# EAGLE design DCZia MechKeyBadge (EAGLE 8.2.1)
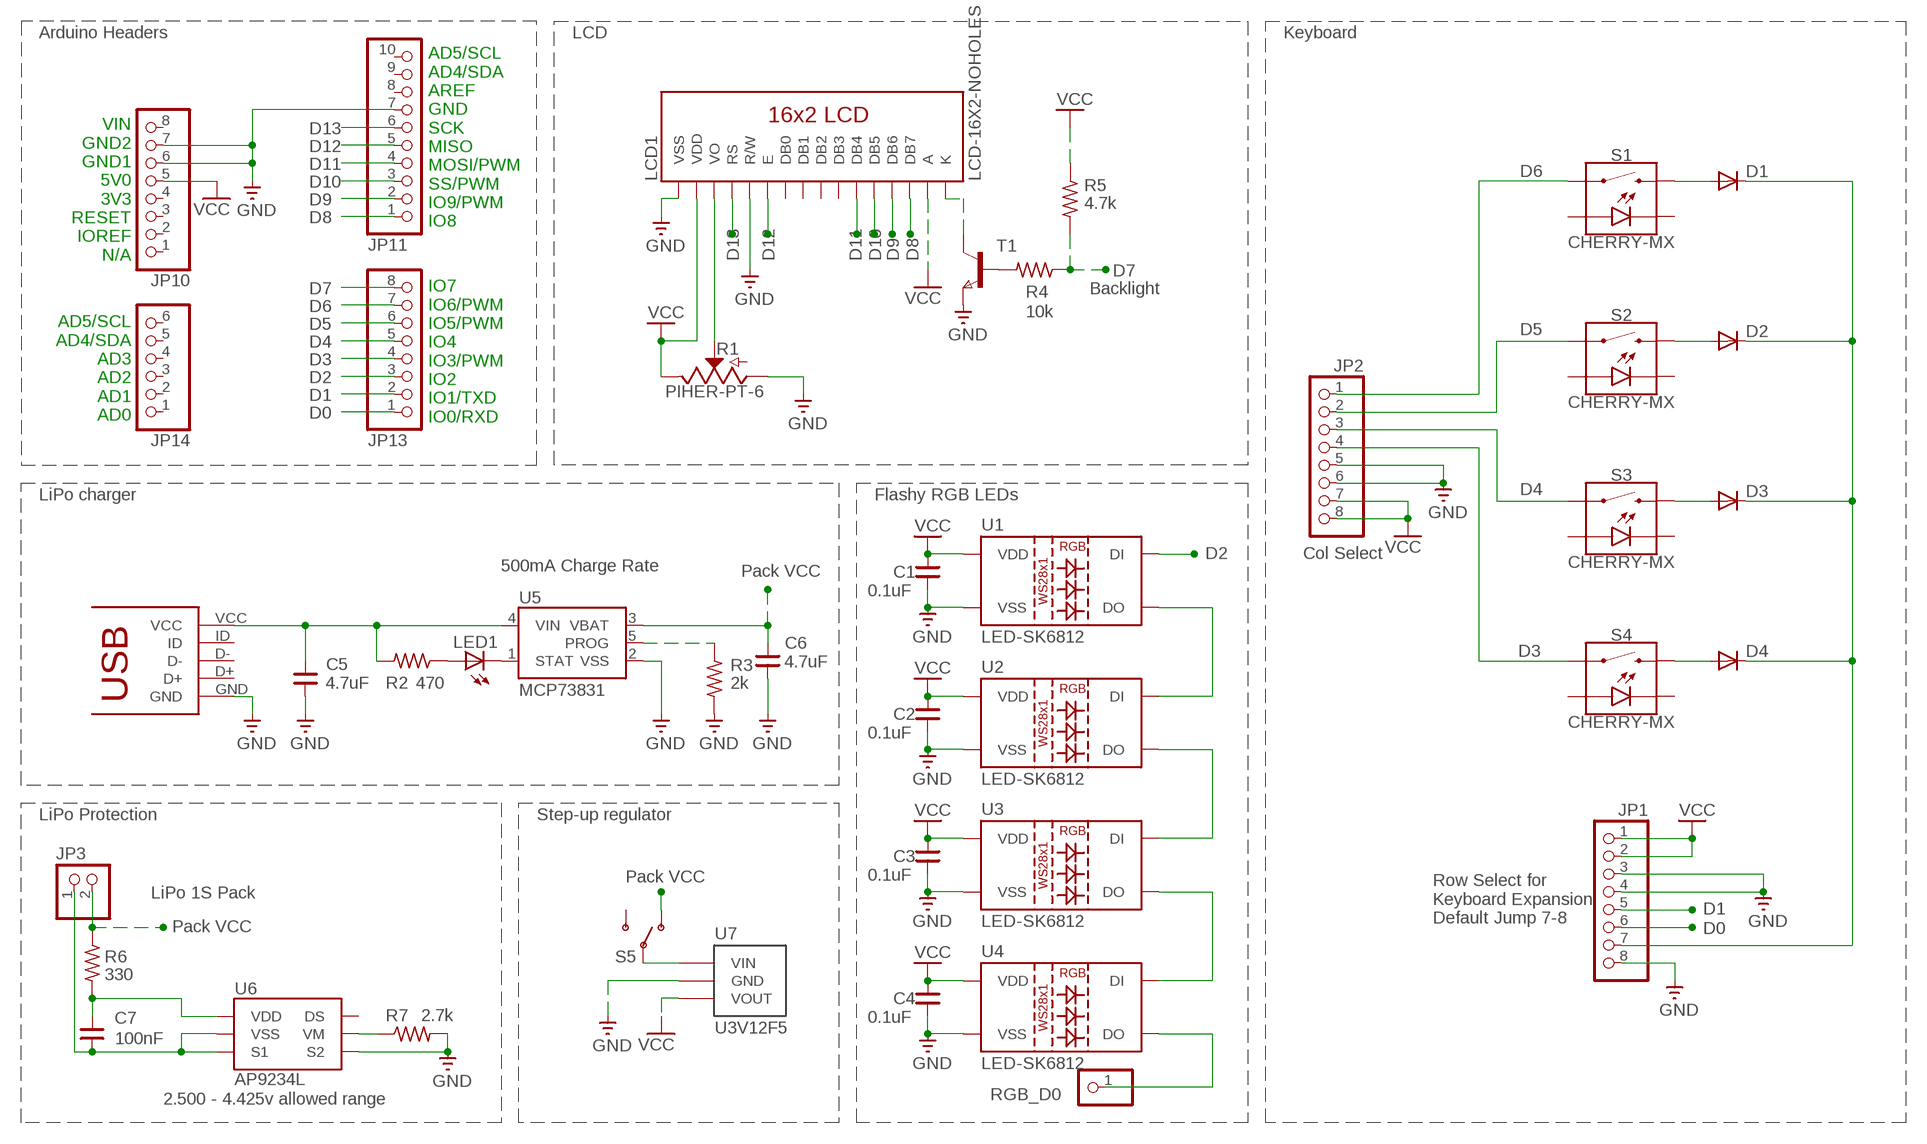
[diagram p0: schematic, sheet 1]

## Parts
C1  0.1uF  CNP-1206  [1206]
C2  0.1uF  CNP-1206  [1206]
C3  0.1uF  CNP-1206  [1206]
C4  0.1uF  CNP-1206  [1206]
C5  4.7uF  CNP-1206  [1206]
C6  4.7uF  CNP-1206  [1206]
C7  100nF  CNP-1206  [1206]
D1  DIODE-SOD123  [SOD123]
D2  DIODE-SOD123  [SOD123]
D3  DIODE-SOD123  [SOD123]
D4  DIODE-SOD123  [SOD123]
JP1  PINHD-1X8  [1X08]
JP2  PINHD-1X8  [1X08]
JP3  PINHD-1X2  [1X02]
JP10  PINHD-1X8  [1X08]
JP11  PINHD-1X10  [1X10]
JP13  PINHD-1X8  [1X08]
JP14  PINHD-1X6  [1X06]
LCD1  LCD-16X2-NOHOLES  [LCD-16X2]
LED1  LEDSMT1206  [1206]
R1  PIHER-PT-6  [PIHER-PT-6]
R2  470  R-US_R1206  [R1206]
R3  2k  R-US_R1206  [R1206]
R4  10k  R-US_R1206  [R1206]
R5  4.7k  R-US_R1206  [R1206]
R6  330  R-US_R1206  [R1206]
R7  2.7k  R-US_R1206  [R1206]
RGB_D0  PINHD-1X1  [1X01]
S1  CHERRY-MX  [CHERRY-MX-LED]
S2  CHERRY-MX  [CHERRY-MX-LED]
S3  CHERRY-MX  [CHERRY-MX-LED]
S4  CHERRY-MX  [CHERRY-MX-LED]
S5  SWITCH-SPDTSMD  [SWITCH_SPDT_SMD]
T1  NPNSOT23  [SOT-23]
U1  LED-SK6812  [SK6812]
U2  LED-SK6812  [SK6812]
U3  LED-SK6812  [SK6812]
U4  LED-SK6812  [SK6812]
U5  MCP73831  [SOT23-5]
U6  AP9234L  [U-DFN2535-6]
U7  U3V12F5  [POLOLU_REGULATOR]
U$1  10118192-0001LF  [10118192-0001LF]

## Nets
D0: JP1.6 JP13.1
D1: JP1.5 JP13.2
D2: JP13.3 U1.P$2(DI)
D3: JP2.4 JP13.4 S4.S1
D4: JP2.3 JP13.5 S3.S1
D5: JP2.2 JP13.6 S2.S1
D6: JP2.1 JP13.7 S1.S1
D7: JP13.8 R4.1 R5.2
D8: JP11.1 LCD1.14(DB7)
D9: JP11.2 LCD1.13(DB6)
D10: JP11.3 LCD1.12(DB5)
D11: JP11.4 LCD1.11(DB4)
D12: JP11.5 LCD1.6(E)
D13: JP11.6 LCD1.4(RS)
GND: C1.P$1 C2.P$1 C3.P$1 C4.P$1 C5.P$1 C6.P$1 JP1.3 JP1.4 JP1.8 JP2.5 JP2.6 JP10.6 JP10.7 JP11.7 LCD1.1(VSS) LCD1.5(R/W) R1.P$1 R3.2 R7.2 T1.2(E) U1.P$1(VSS) U2.P$1(VSS) U3.P$1(VSS) U4.P$1(VSS) U5.2(VSS) U6.S2 U7.2(GND) U$1.GND
N$1: LCD1.3(VO) R1.P$2
N$2: U1.P$4(DO) U2.P$2(DI)
N$3: U2.P$4(DO) U3.P$2(DI)
N$4: U3.P$4(DO) U4.P$2(DI)
N$9: D4.A S4.S2
N$10: D1.A S1.S2
N$11: D2.A S2.S2
N$12: D3.A S3.S2
N$13: LED1.A R2.1
N$14: LED1.C U5.1(STAT)
N$15: R3.1 U5.5(PROG)
N$16: RGB_D0.1 U4.P$4(DO)
N$17: D1.C D2.C D3.C D4.C JP1.7
N$18: R4.2 T1.3(B)
N$19: LCD1.16(K) T1.1(C)
N$20: S5.2(P) U7.3(VIN)
N$21: C5.P$2 R2.2 U5.4(VIN) U$1.VCC
N$22: R7.1 U6.VM
N$23: C7.P$2 JP3.1 U6.S1 U6.VSS
N$24: C7.P$1 R6.2 U6.VDD
PACK_VCC: C6.P$2 JP3.2 R6.1 S5.1(O) U5.3(VBAT)
VCC: C1.P$2 C2.P$2 C3.P$2 C4.P$2 JP1.1 JP1.2 JP2.7 JP2.8 JP10.5 LCD1.2(VDD) LCD1.15(A) R1.P$3 R5.1 U1.P$3(VDD) U2.P$3(VDD) U3.P$3(VDD) U4.P$3(VDD) U7.1(VOUT)
Unconnected: JP10.1 JP10.2 JP10.3 JP10.4 JP10.8 JP11.8 JP11.9 JP11.10 JP14.1 JP14.2 JP14.3 JP14.4 JP14.5 JP14.6 LCD1.7(DB0) LCD1.8(DB1) LCD1.9(DB2) LCD1.10(DB3) S1.A S1.K(C) S2.A S2.K(C) S3.A S3.K(C) S4.A S4.K(C) S5.3(S) U6.DS U$1.D+ U$1.D- U$1.ID

## Notes on the sheet
- Arduino Headers | LCD | Keyboard
- D13
- D12
- D11
- D6
- D10
- D9
- D8
- AD5/SCL
  AD4/SDA
  AREF
  GND
  SCK
  MISO
  MOSI/PWM
  SS/PWM
  IO9/PWM
  IO8
- VIN
  GND2
  GND1
  5V0
  3V3
  RESET
  IOREF
  N/A
- D13 | D12 | D11 | D10 | D9 | D8
- D7
- D7 | Backlight
- D6
- D5
- D5
- D4
- D3
- D2
- D1
- D0
- AD5/SCL
  AD4/SDA
  AD3
  AD2
  AD1
  AD0
- IO7
  IO6/PWM
  IO5/PWM
  IO4
  IO3/PWM
  IO2
  IO1/TXD
  IO0/RXD
- D4
- LiPo charger | Flashy RGB LEDs
- D2 | Col Select
- 500mA Charge Rate
- Pack VCC
- D3
- LiPo Protection | Step-up regulator
- Pack VCC
- LiPo 1S Pack
- D1
- Row Select for
  Keyboard Expansion
  Default Jump 7-8
- Pack VCC | D0
- 2.500 - 4.425v allowed range

## Library data of the parts
C1-C7 = cap-master:CNP-: NON-POLARIZED CAP
D1-D4 = diode-1:DIODE-: DIODE
JP1 JP2 JP10 JP13 = pinhead:PINHD-1X8: PIN HEADER
JP3 = pinhead:PINHD-1X2: PIN HEADER
JP11 = pinhead:PINHD-1X10: PIN HEADER
JP14 = pinhead:PINHD-1X6: PIN HEADER
LCD1 = snurkle:LCD-16X2-NOHOLES
LED1 = adafruit:LED: LED OSRAM: - CHIPLED LG R971, LG N971, LY N971, LG Q971, LY Q971, LO R971, LY R971 LH N974, LH R974 LS Q976, LO Q976, LY Q976 LO Q996 - Hyper CHIPLED LW Q18S LB Q993, LB Q99A, LB R99A - SideLED LS A670, LO A670, LY A670, LG A670, LP A670 LB A673, LV A673, LT A673, LW A673 LH A674 LY A675 LS A676, LA A676, LO A676, LY A676, LW A676 LS A679, LY A679, LG A679 - Hyper Micro SIDELED® LS Y876, LA Y876, LO Y876, LY Y876 LT Y87S - SmartLED LW L88C, LW L88S LB L89C, LB L89S, LG L890 LS L89K, LO L89K, LY L89K LS L896, LA L896, LO L896, LY L896 - TOPLED LS T670, LO T670, LY T670, LG T670, LP T670 LSG T670, LSP T670, LSY T670, LOP T670, LYG T670 LG T671, LOG T671, LSG T671 LB T673, LV T673, LT T673, LW T673 LH T674 LS T676, LA T676, LO T676, LY T676, LB T676, LH T676, LSB T676, LW T676 LB T67C, LV T67C, LT T67C, LS T67K, LO T67K, LY T67K, LW E67C LS E67B, LA E67B, LO E67B, LY E67B, LB E67C, LV E67C, LT E67C LW T67C LS T679, LY T679, LG T679 LS T770, LO T770, LY T770, LG T770, LP T770 LB T773, LV T773, LT T773, LW T773 LH T774 LS E675, LA E675, LY E675, LS T675 LS T776, LA T776, LO T776, LY T776, LB T776 LHGB T686 LT T68C, LB T68C - Hyper Mini TOPLED® LB M676 - Mini TOPLED Santana® LG M470 LS M47K, LO M47K, LY M47K Source: http://www.osram.convergy.de/
R1 = snurkle:PIHER-PT-6
R2-R7 = resistor:R-US_: RESISTOR, American symbol
RGB_D0 = pinhead:PINHD-1X1: PIN HEADER
S1-S4 = snurkle:CHERRY-MX
S5 = SparkFun-Retired:SWITCH-SPDT: SPDT Switch Simple slide switch, Spark Fun Electronics SKU : COM-00102 DPDT SMT slide switch, AYZ0202, SWCH-08179
T1 = zetex:NPNSOT23: NPN TRANSISTOR; MPN: DSS20201L-7; OC_FARNELL: 1710688; OC_NEWARK: 25R4555
U1-U4 = snurkle:LED-SK6812: SK6812 RGB LED - A 5050LED controller with 3 RGB LEDs in a single package
U5 = SparkFun-IC-Power:MCP73831: MCP73831T Li-Ion, Li-Pol Controller Miniature single cell, fully integrated Li-Ion, Li-polymer charge management controller Datasheet <http://ww1.microchip.com/downloads/en/DeviceDoc/20001984g.pdf> SparkFun Products: SparkFun ESP32 Thing <https://www.sparkfun.com/products/13907> SparkFun 9DoF Razor IMU M0 <https://www.sparkfun.com/products/14001>; PROD_ID: IC-09995
U6 = snurkle:AP9234L: Diodes, Inc Battery Protection chip AP9234L <https://www.diodes.com/assets/Datasheets/AP9234L.pdf>
U7 = snurkle:U3V12F5: Pololu 5V Step-Up Voltage Regulator U3V12F5 <https://www.pololu.com/product/2115>
U$1 = AllAboutEE:10118192-0001LF: USB Connectors 5P MICRO USB TYPE B RECEPTACLE.; COLOR: Black; GENDER: Female

## Board
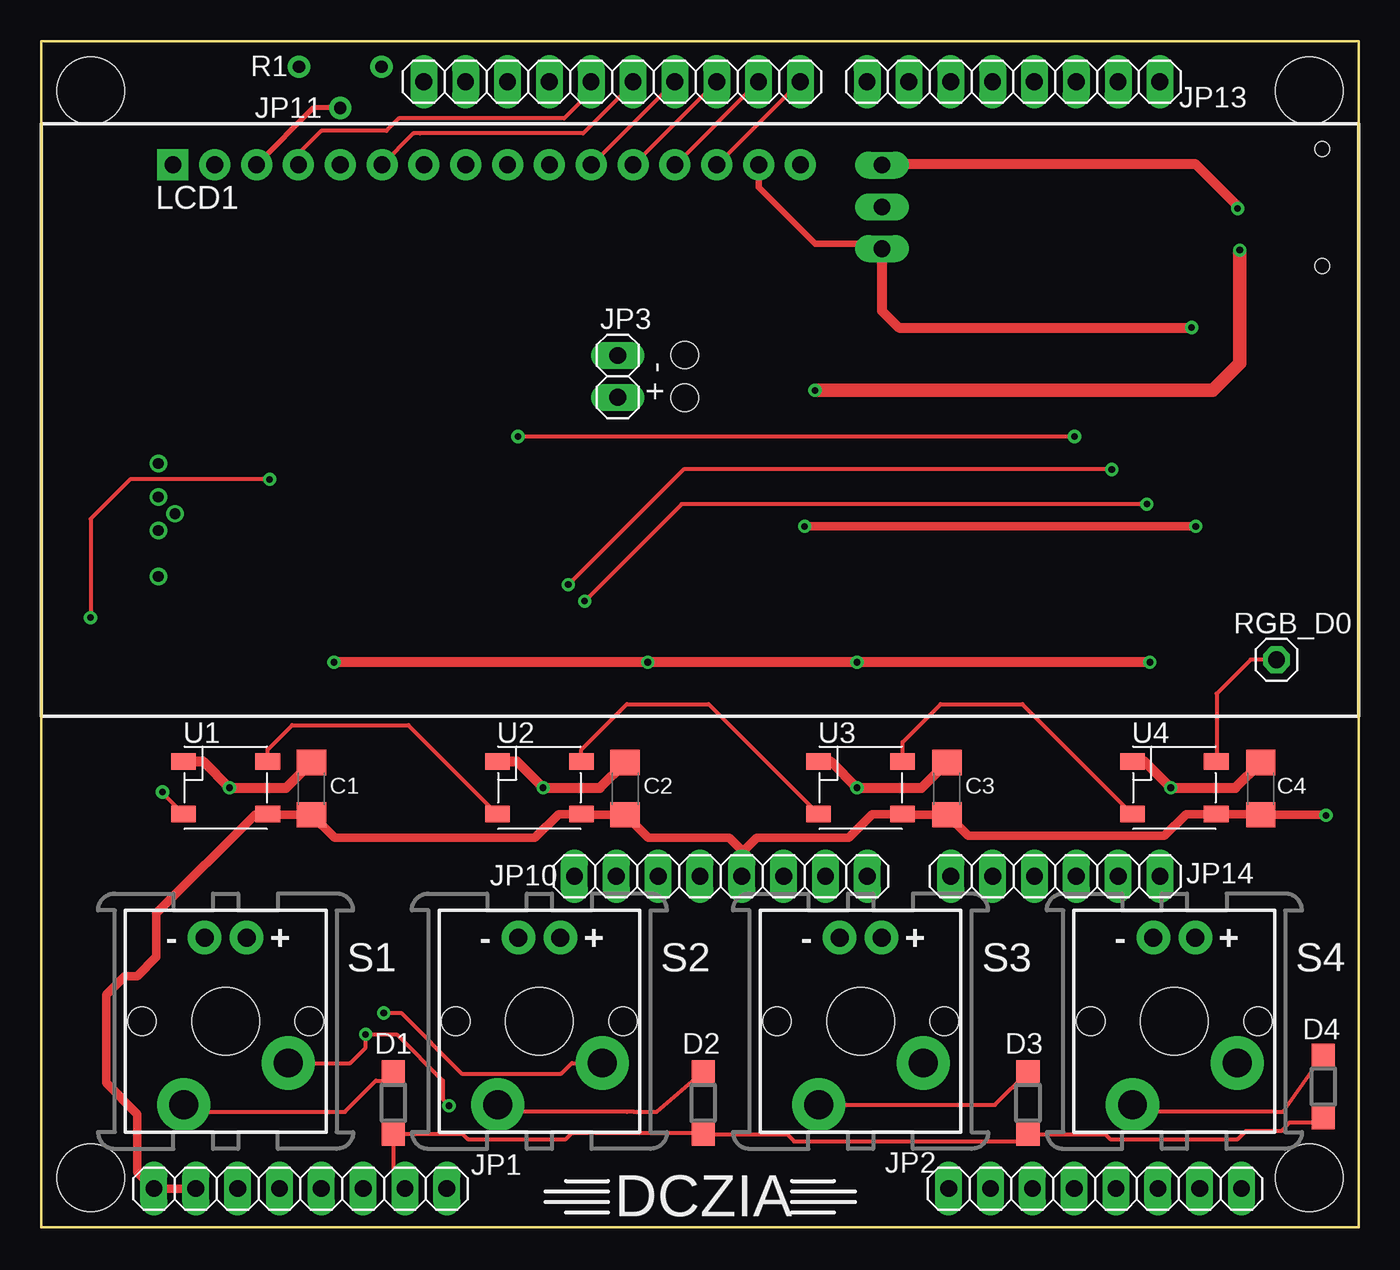
[diagram p1: board, top side]
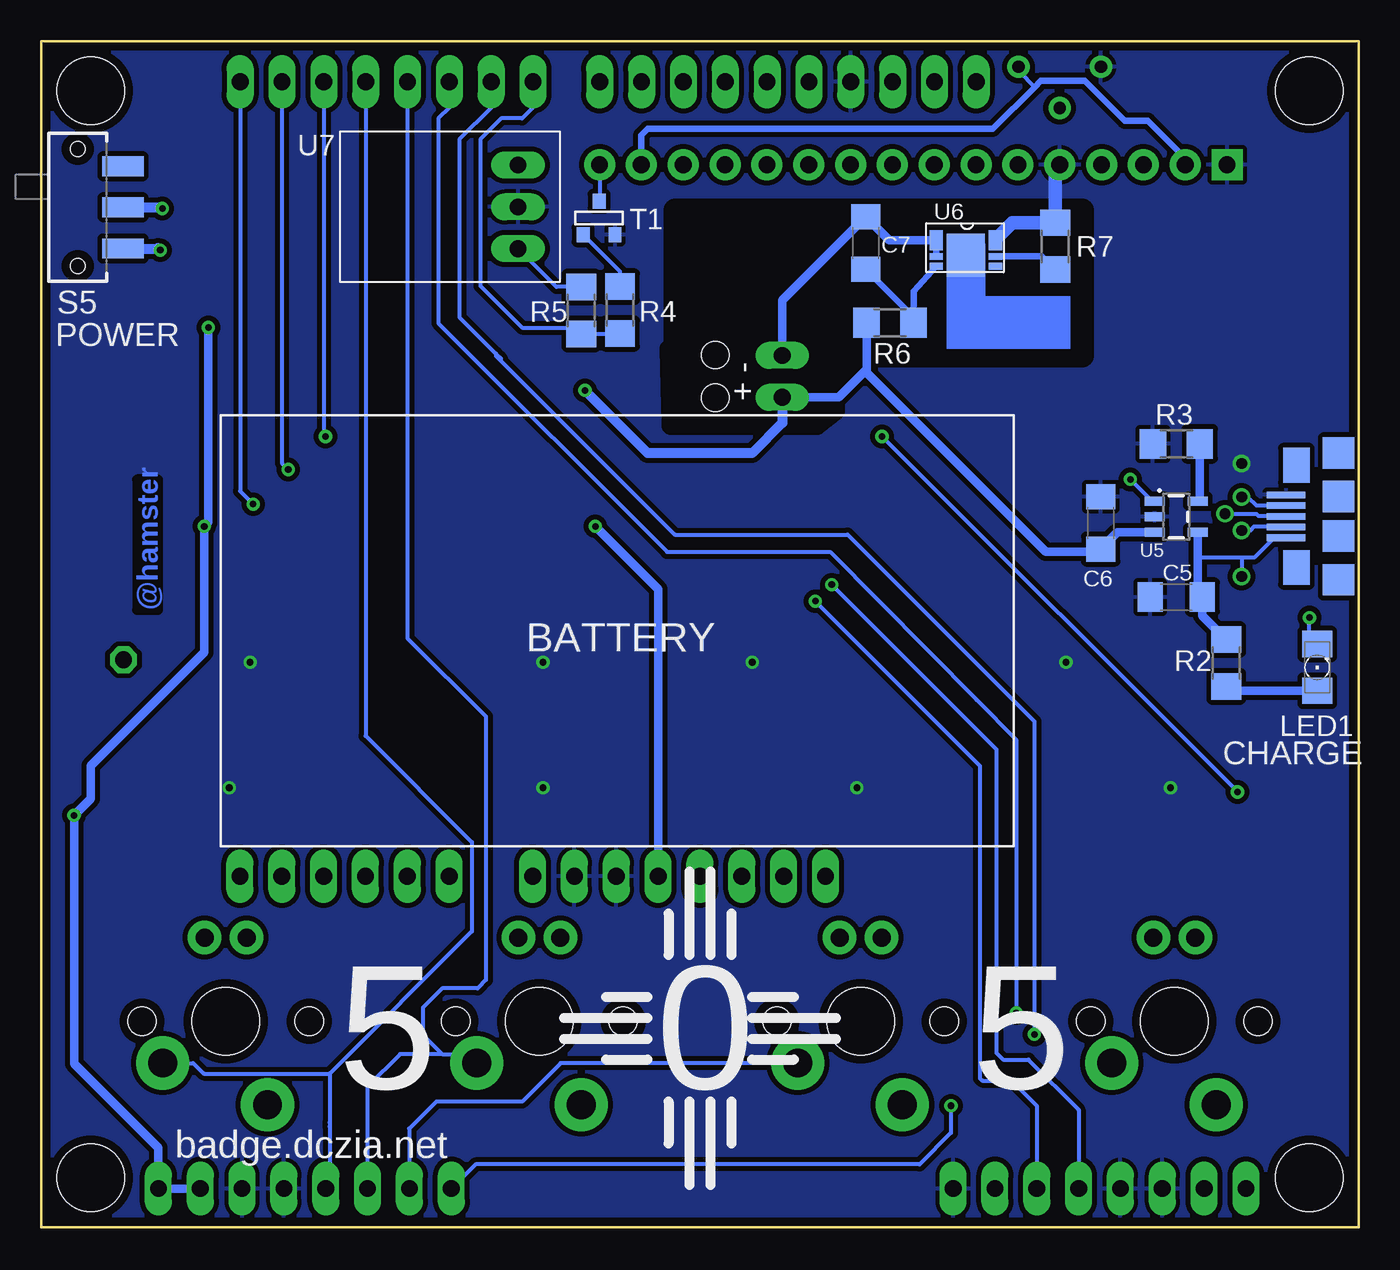
[diagram p2: board, bottom side, seen from below]

Size 80 x 72 mm. Coordinates in mm from the lower left corner, seen from the top.
Outline: 0,0 0,72 80,72 80,0 0,0
Copper layers (1*16): Top 0.0178mm / dielectric 59mil / Bottom 0.0178mm
Design rules "SSC-EAGLE-2Lyr_v1.0.0.3 *": minimum track width 6mil, minimum drill 14mil, track to track 6mil, track to pad 6mil, pad to pad 6mil, via to via 6mil, smd to smd 6mil, copper to edge 20mil, drill to drill 16mil, minimum pad ring 12mil, minimum via ring 8mil, stop-mask expansion 3mil, vias tented up to drill 15mil, thermal gap 10mil
Holes 1.65 mm at 39.08,52.94 39.08,50.35
Holes 4.09 mm at 3,3 77,3 3,69 77,69
bRestrict: area 16.8,52.9 to 41.5,61.7; area 1.9,40.6 to 3.4,45.7; area 31.8,48.6 to 41.9,53.3

### Footprints (pad centres in the part's own frame; a part is rotated, then mirrored left to right if it is on the bottom)
1206 = smd 1.524 x 1.778: P$1 -1.587,0; P$2 1.587,0
SOD123 = smd 1.4 x 1.4: A 1.9,0; C -1.9,0
1X08 = drill 1.016 long: 1 -8.89,0; 2 -6.35,0; 3 -3.81,0; 4 -1.27,0; 5 1.27,0; 6 3.81,0; 7 6.35,0; 8 8.89,0
1X02 = drill 1.016 long: 1 -1.27,0; 2 1.27,0
1X10 = drill 1.016 long: 1 -11.43,0; 2 -8.89,0; 3 -6.35,0; 4 -3.81,0; 5 -1.27,0; 6 1.27,0; 7 3.81,0; 8 6.35,0; 9 8.89,0; 10 11.43,0
1X06 = drill 1.016 long: 1 -6.35,0; 2 -3.81,0; 3 -1.27,0; 4 1.27,0; 5 3.81,0; 6 6.35,0
LCD-16X2 = drill 1.016 pad 1.88 square: 1 -32,15.5 | drill 1.016 pad 1.88: 2 -29.46,15.5; 3 -26.92,15.5; 4 -24.38,15.5; 5 -21.84,15.5; 6 -19.3,15.5; 7 -16.76,15.5; 8 -14.22,15.5; 9 -11.68,15.5; 10 -9.14,15.5; 11 -6.6,15.5; 12 -4.06,15.5; 13 -1.52,15.5; 14 1.02,15.5; 15 3.56,15.5; 16 6.1,15.5
1206' = smd 1.6 x 1.803: A -1.422,0; C 1.422,0
PIHER-PT-6 = drill 0.75: P$1 2.5,2.5; P$2 0,0; P$3 2.5,-2.5
R1206 = smd 1.6 x 1.803: 1 -1.422,0; 2 1.422,0
1X01 = drill 1.016 octagon: 1 0,0
CHERRY-MX-LED = drill 1.092 pad 2.032: A -1.27,-5.08; K 1.27,-5.08 | drill 1.753 pad 3.226: S1 -3.81,2.54; S2 2.54,5.08 | hole 4.089: 0,0 | hole 1.707: -5.08,0; 5.08,0
SWITCH_SPDT_SMD = smd 1.2 x 2.5: 1 -2.5,-2.75; 2 0,-2.75; 3 2.5,-2.75 | hole 0.9: -3.55,0; 3.55,0
SOT-23 = smd 0.787 x 0.889: 1 0.025,-1.016; 2 -0.94,1.016; 3 0.991,1.016
SK6812 = smd 1.5 x 1: P$1 -2.55,1.6; P$2 -2.55,-1.6; P$3 2.55,-1.6; P$4 2.55,1.6
SOT23-5 = smd 0.55 x 1.2: 1 -0.95,-1.3; 2 0,-1.3; 3 0.95,-1.3; 4 0.95,1.3; 5 -0.95,1.3
U-DFN2535-6 = smd 0.4 x 0.8: DS 0.975,1.8; VDD 0.975,-1.8; VM 0.375,1.8; VSS 0.375,-1.8 | smd 2.6 x 2.3: EP 0.3,0 | smd 1.2 x 0.8: S1 -0.6,-1.8; S2 -0.6,1.8
POLOLU_REGULATOR = drill 1.016 long: 1 -2.54,0; 2 0,0; 3 2.54,0
10118192-0001LF = smd 0.4 x 2.35: D+ -0.05,1.725; D- -0.7,1.725; GND 1.25,1.725; ID 0.6,1.725; VCC -1.35,1.725 | smd 2.1 x 1.6: P$1 -3.15,1.1; P$2 3.05,1.1 | smd 1.9 x 1.9: P$3 -3.9,-1.45; P$4 -1.25,-1.45; P$5 1.15,-1.45; P$6 3.8,-1.45

### Placement (x,y rotation side)
C1  16.41,26.61 270 top
C2  35.45,26.61 270 top
C3  54.99,26.61 270 top
C4  74.04,26.61 270 top
C5  11.08,38.25 0 bottom
C6  15.67,42.75 270 bottom
C7  29.94,59.75 90 bottom
D1  21.38,7.54 90 top
D2  40.19,7.54 90 top
D3  59.91,7.54 90 top
D4  77.85,8.54 90 top
JP1  15.74,2.33 0 top
JP2  63.99,2.33 0 top
JP3  35,51.65 270 top
JP10  41.27,21.3 0 top
JP11  34.66,69.53 180 top
JP13  59.03,69.53 180 top
JP14  61.58,21.3 0 top
LCD1  40,49 0 top
LED1  [1206']  2.53,33.98 90 bottom
R1  18.16,67.94 90 top
R2  8.05,34.25 90 bottom
R3  11.08,47.55 180 bottom
R4  44.85,55.68 90 bottom
R5  47.2,55.65 270 bottom
R6  28.46,54.91 0 bottom
R7  18.44,59.55 90 bottom
RGB_D0  75,34.45 0 top
S1  11.2,12.5 180 top
S2  30.25,12.5 180 top
S3  49.75,12.5 180 top
S4  68.8,12.5 180 top
S5  77.78,61.91 90 bottom
T1  46.1,61.26 180 bottom
U1  11.2,26.67 0 top
U2  30.25,26.67 0 top
U3  49.75,26.67 0 top
U4  68.8,26.67 0 top
U5  11.08,43.12 270 bottom
U6  23.86,59.31 270 bottom
U7  51.05,61.94 90 bottom
U$1  2.69,43.2 90 bottom

### Tracks (layer width: path | path; a pad name or v marks a point on that pad's centre or on a via)
D0  (via drill 0.4)
  Top 0.254: v67.13,43.89 38.89,43.89 v33,38
  Bottom 0.254: v33,38 23,28 23,9.03 22.86,8.89 21.08,8.89 19.56,7.37 19.56,2.34 JP1.6 | JP13.1 67.92,44.68 v67.13,43.89
D1  (via drill 0.4)
  Top 0.254: v65,46 39,46 v32,39
  Bottom 0.254: JP13.2 65.38,46.38 v65,46 | v32,39 22,29 22,10.57 21.59,10.16 20.07,10.16 17.02,7.11 17.02,2.34 JP1.5
D2  (via drill 0.4)
  Top 0.254: v28.96,48.01 v62.74,48.01 v62.75,48 | v7.37,26.42 7.37,26.35 U1.P$2
  Bottom 0.254: JP13.3 62.84,47.91 v62.75,48 | v7.37,26.42 v28.96,48.01
D3
  Bottom 0.254: 62.48,9.31 70.12,9.31 70.77,9.96 S4.S1 73.15,10.5 | JP13.4 60.3,29.82 53.85,23.37 53.85,17.95 62.48,9.31 | 62.48,9.31 62.48,6.35 | 62.48,6.35 62.48,6.1 | 62.48,6.35 62.48,2.57 JP2.4
D4
  Bottom 0.254: JP13.5 57.76,35.76 53,31 53,15 53.5,14.5 55.66,14.5 56.83,13.33 56.83,11.67 55.66,10.5 | 55.66,10.5 54.1,10.5 S3.S1 53.56,9.49 | JP2.3 60.2,2.35 60.2,8.51 58.2,10.5 55.66,10.5
D5  (via drill 0.4)
  Top 0.254: 20.85,13 v20.8,13 21.85,13 25.53,9.31 31.57,9.31 32.22,9.96 S2.S1
  Bottom 0.254: v20.8,13 20.8,29.6 23.2,32 32.1,41 42,41 55.88,54.88 55.88,67.31 55.22,67.97 JP13.6 | S2.S1 48.46,9.96 50.8,7.62 56.01,7.62 57.66,5.97 57.66,2.35 JP2.2
D6  (via drill 0.4)
  Top 0.254: S1.S1 18.76,9.96 19.7,10.9 v19.7,11.7 21.57,11.7 24.38,8.89 24.38,7.75 v24.77,7.37
  Bottom 0.254: v19.7,11.7 19.7,30.7 31.04,42.04 41.53,42.04 52.39,52.9 52.39,53.02 | 52.39,53.02 52.07,52.7 | v24.77,7.37 24.77,5.71 26.67,3.81 53.62,3.81 JP2.1 | JP13.7 52.68,67.97 54.61,66.04 54.61,55.24 52.39,53.02
D7
  Bottom 0.254: JP13.8 50.14,67.97 50.8,67.31 52.07,67.31 53.34,66.04 53.34,57.15 50.8,54.61 47.58,54.61 R5.2 44.88,54.23 R4.1
D8
  Top 0.254: LCD1.14 41.06,64.5 JP11.1
D9
  Top 0.254: LCD1.13 38.52,64.5 JP11.2
D10
  Top 0.254: LCD1.12 35.98,64.5 JP11.3
D11
  Top 0.254: LCD1.11 33.44,64.5 JP11.4
D12
  Top 0.254: JP11.5 35.93,69.43 32.9,66.4 23,66.4 | 23,66.4 22.6,66.4 | 23,66.4 22.6,66.4 | 22.6,66.4 LCD1.6
D13
  Top 0.254: JP11.6 33.39,68.95 31.75,67.31 21.72,67.31 20.95,66.55 17.02,66.55 15.62,65.15 LCD1.4
GND  (via drill 0.4, 0.65)
  Top 0.61: U1.P$1 9.83,28.27 v11.43,26.67 14.88,26.67 C1.P$1 | U2.P$1 28.88,28.27 v30.48,26.67 33.92,26.67 C2.P$1 | U3.P$1 47.93,28.27 v49.53,26.67 53.46,26.67 C3.P$1 | U4.P$1 66.98,28.27 v68.58,26.67 72.51,26.67 C4.P$1 | v67.31,34.29 v49.53,34.29 v36.83,34.29 v17.78,34.29
  Bottom 0.254: 22,60 22.12,60 U6.S2
  Bottom 0.813: LCD1.5 18.44,64.22 R7.2 21.03,60.97 22,60
  other vias: 7.11,46.35
  pour Bottom (isolate 0.305): 0,72 80,72 80,0 0,0
N$1
  Top 0.305: R1.P$2 16.52,67.94 LCD1.3
N$2
  Top 0.254: U1.P$4 13.75,28.99 15.24,30.48 22.29,30.48 U2.P$2
N$3
  Top 0.254: U2.P$4 32.8,28.99 35.56,31.75 40.52,31.75 U3.P$2
N$4
  Top 0.254: U3.P$4 52.3,29.44 54.61,31.75 59.57,31.75 U4.P$2
N$6  (via drill 0.65)
  Bottom 0.254: v7.11,44.32 6.73,44.32 6.22,43.81 5.08,43.81
N$7  (via drill 0.65)
  Bottom 0.254: v8.13,43.31 6.22,43.31 6.1,43.18 4.95,43.18
N$8  (via drill 0.65)
  Bottom 0.254: v7.11,42.29 6.6,42.29 6.35,42.55 4.83,42.55
N$9
  Top 0.254: S4.S2 66.68,7 74.93,7 75,7 75.41,7 D4.A
N$10
  Top 0.254: S1.S2 9.08,7 18.43,7 20.32,8.89 20.83,8.89 D1.A
N$11
  Top 0.254: S2.S2 28.13,7 35.56,7 36,7 37.37,7 D2.A
N$12
  Top 0.254: S3.S2 57.93,7.42 57.93,7.45 D3.A
N$13
  Bottom 0.508: LED1.A 7.78,32.56 R2.1
N$14  (via drill 0.4)
  Top 0.254: v3,37 3,43 5.4,45.4 v13.87,45.4
  Bottom 0.254: v3,37 3,36.04 2.53,35.57 LED1.C | U5.1 12.55,44.08 v13.87,45.4
N$15
  Bottom 0.508: R3.1 9.66,44.2 U5.5
N$16
  Top 0.254: RGB_D0.1 73.44,34.45 71.37,32.38 71.37,28.29 U4.P$4
N$17
  Top 0.254: D1.C 25.6,5.64 25.91,5.33 31.85,5.33 32.25,5.74 39.72,5.74 D2.C 45.29,5.64 45.72,5.21 59.48,5.21 D3.C 64.59,5.64 64.9,5.33 72.64,5.33 73.15,5.84 75.31,5.84 75.82,6.35 77.56,6.35 D4.C | D1.C 20.88,5.64 | D1.C 21.38,3.04 JP1.7
N$18
  Bottom 0.254: R4.2 44.85,58.01 T1.3
N$19
  Bottom 0.254: LCD1.16 46.1,62.3 T1.1
N$20  (via drill 0.4)
  Top 0.61: v72.64,61.85 72.64,61.98 70.1,64.52 51.09,64.52 U7.3
  Bottom 0.61: S5.2 72.7,61.91 v72.64,61.85
N$21  (via drill 0.65)
  Bottom 0.254: 9.61,42 U5.4 | U$1.VCC 5.14,41.85 6.35,40.64 7.11,40.64 | 7.11,40.64 9.78,40.64 | 7.11,40.64 v7.11,39.5
  Bottom 0.508: U5.4 9.78,40.64 9.78,38.54 C5.P$2 9.5,37.12 R2.2
N$22
  Bottom 0.406: U6.VM 19.24,58.93 R7.1
N$23
  Bottom 0.406: U6.S1 U6.VSS
  Bottom 0.508: U6.S1 28.51,59.91 C7.P$2 35,56.27 JP3.1
N$24
  Bottom 0.406: U6.VDD 27.03,56.82 R6.2 27.04,55.27 C7.P$1
PACK_VCC  (via drill 0.4)
  Top 0.813: v72.77,59.31 72.77,52.45 71.12,50.8 v46.99,50.8
  Bottom 0.508: 29.88,52.07 R6.1 | 29.88,52.07 29.88,51.88 19,41 15.83,41 C6.P$2 14.66,42.17 U5.3 | JP3.2 31.57,50.38 29.88,52.07
  Bottom 0.61: S5.1 72.92,59.41 72.9,59.44 v72.77,59.31 | JP3.2 35,48.82 36.83,46.99 43.18,46.99 v46.99,50.8
VCC  (via drill 0.4)
  Top 0.406: LCD1.15 43.56,63.12 46.99,59.69 50.76,59.69 U7.1
  Top 0.508: 7,16.4 7,19.05 13.02,25.07 U1.P$3 13.79,25.03 C1.P$2 17.81,23.62 29.97,23.62 31.42,25.07 U2.P$3 32.84,25.03 C2.P$2 36.86,23.62 41.78,23.62 42.54,22.86 JP10.5 42.55,22.73 43.43,23.62 49.02,23.62 50.47,25.07 U3.P$3 52.34,25.03 C3.P$2 56.27,23.75 68.2,23.75 69.52,25.07 U4.P$3 74,25.07 | 7,16.4 7,16.38 | v46.35,42.55 v70.1,42.55 | 7,16.4 5.84,15.24 5.08,15.24 3.94,14.1 3.94,8.76 5.84,6.86 5.84,3.34 JP1.1 JP1.2 | C4.P$2 77.97,25.03
  Top 0.61: 74,25.07 C4.P$2 | 77.97,25.03 v78,25 | U7.1 51.05,55.63 52.07,54.61 v69.85,54.61
  Bottom 0.254: R5.1 48.73,57.08 U7.1 | R1.P$3 20.66,70.19 19.68,69.22
  Bottom 0.406: LCD1.2 10.54,64.9 12.83,67.18 14.22,67.18 16.64,69.6 19.3,69.6 19.68,69.22 22.23,66.67 43.18,66.67 43.56,66.3 LCD1.15
  Bottom 0.508: JP2.7 JP2.8 72.9,2.35 72.9,4.83 78,9.93 v78,25 77,26 77,28 70.1,34.9 v70.1,42.55 69.85,42.8 v69.85,54.61 | JP10.5 42.54,38.73 v46.35,42.55
(copper drawn outside any net)
  shapes: Bottom area x2

### Text on the board
Bottom: @hamster
bPlace: BATTERY | 5 | 0 | 5 | badge.dczia.net
tNames: + - | DCZIA
bNames: POWER | + - | CHARGE
tValues: - +